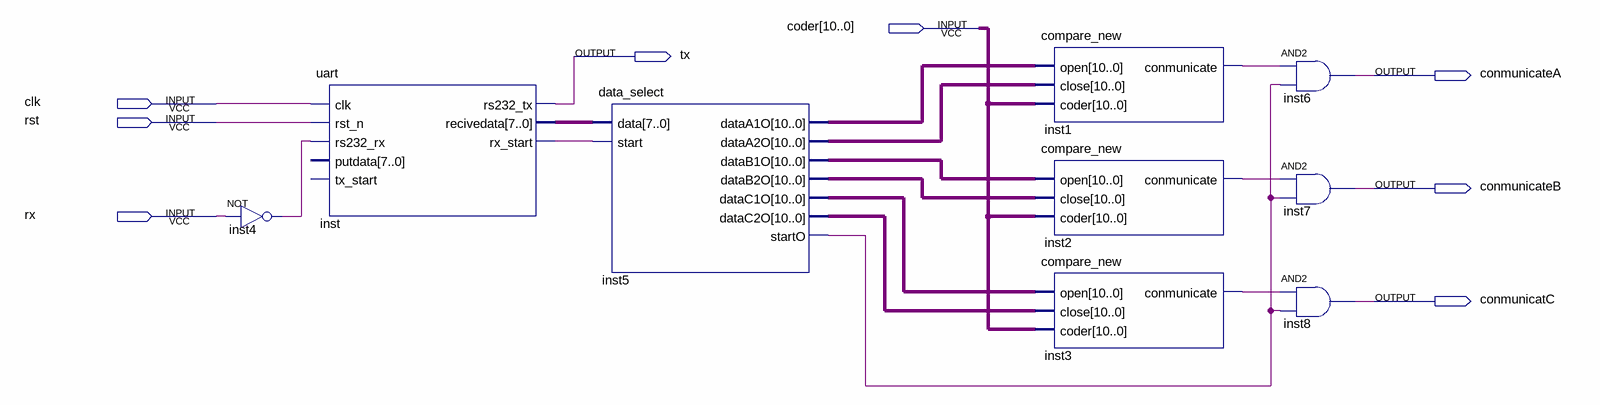
[diagram p0: schematic sheet]
// Quartus schematic main_new.bdf as structural Verilog: 9 symbols, 8 pins
module main_new (
  input  [10:0] coder,
  input  clk,
  input  rst,
  input  rx,
  output tx,
  output conmunicateA,
  output conmunicateB,
  output conmunicatC
);

  wire inst1_conmunicate, inst2_conmunicate, inst3_conmunicate, inst4_out, inst5_starto, inst_rx_start;
  wire [7:0] inst_recivedata;
  wire [10:0] inst5_dataa1o, inst5_dataa2o, inst5_datab1o, inst5_datab2o, inst5_datac1o, inst5_datac2o;

  not inst4 (inst4_out, rx);
  uart inst (
    .clk(clk), .rst_n(rst), .rs232_rx(inst4_out), .rs232_tx(tx), .recivedata(inst_recivedata),
    .rx_start(inst_rx_start));  // open: putdata, tx_start
  data_select inst5 (
    .data(inst_recivedata), .start(inst_rx_start), .dataA1O(inst5_dataa1o), .dataA2O(inst5_dataa2o),
    .dataB1O(inst5_datab1o), .dataB2O(inst5_datab2o), .dataC1O(inst5_datac1o), .dataC2O(inst5_datac2o),
    .startO(inst5_starto));
  compare_new inst1 (.open(inst5_dataa1o), .close(inst5_dataa2o), .coder(coder), .conmunicate(inst1_conmunicate));
  compare_new inst2 (.open(inst5_datab1o), .close(inst5_datab2o), .coder(coder), .conmunicate(inst2_conmunicate));
  compare_new inst3 (.open(inst5_datac1o), .close(inst5_datac2o), .coder(coder), .conmunicate(inst3_conmunicate));
  and inst6 (conmunicateA, inst1_conmunicate, inst5_starto);
  and inst7 (conmunicateB, inst2_conmunicate, inst5_starto);
  and inst8 (conmunicatC, inst3_conmunicate, inst5_starto);
endmodule
